# Altium schematic sheet conroller_flying_pcb.SchDoc
size A3
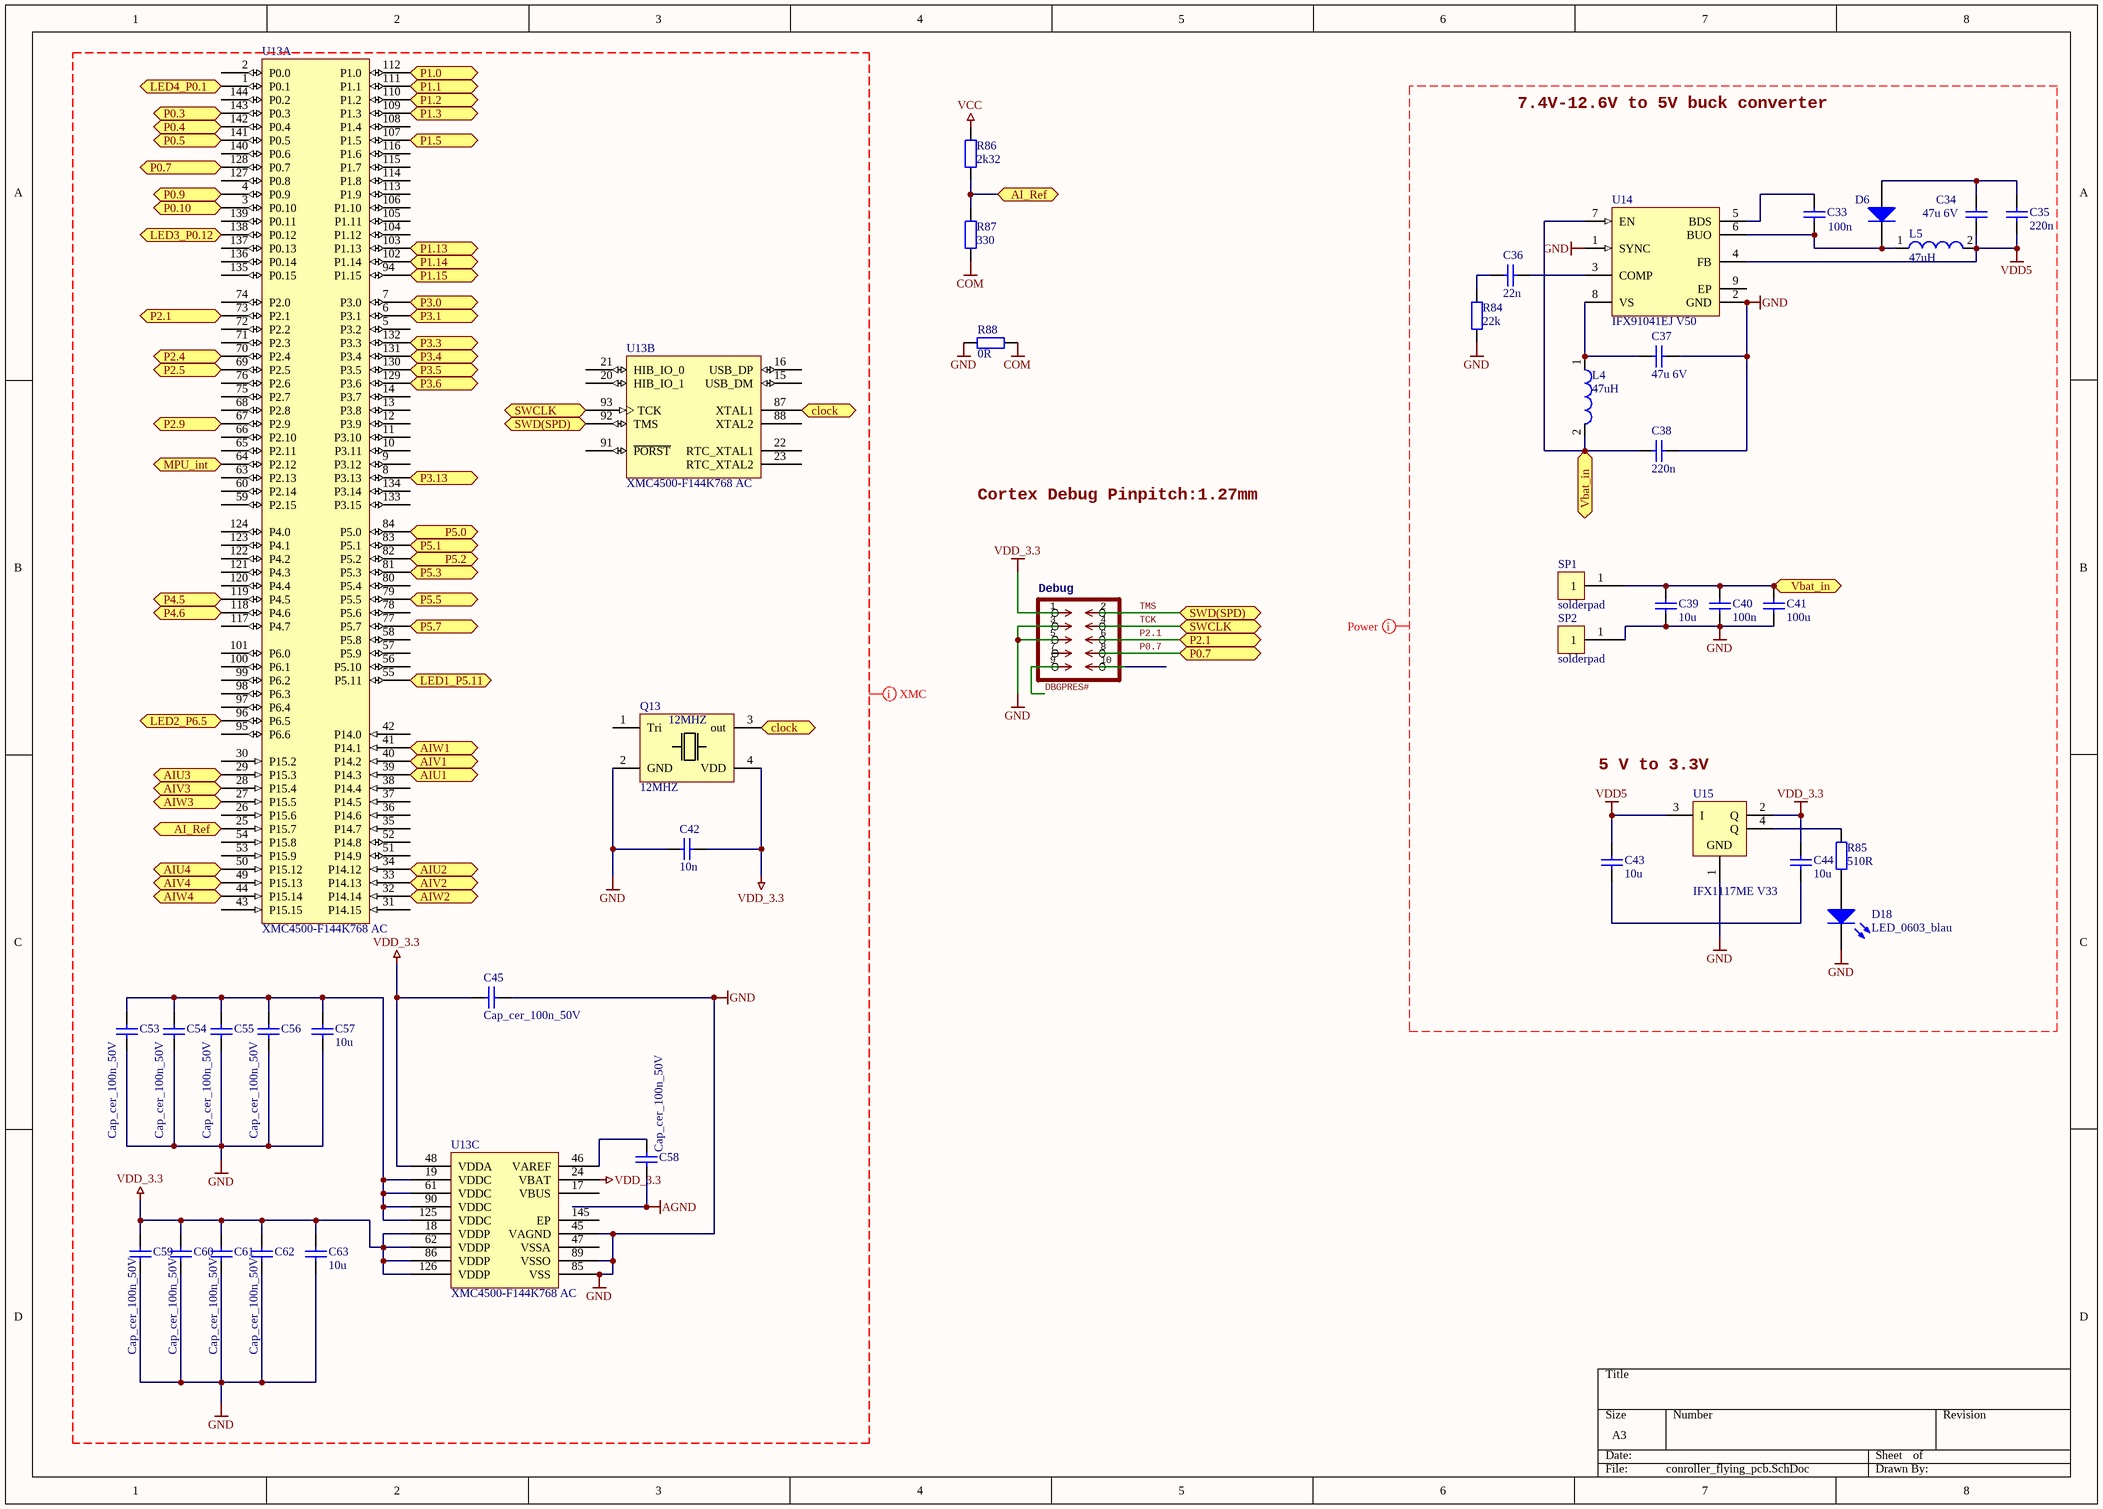
[diagram p0: conroller_flying_pcb.SchDoc]

## Parts
C33  100n  [_0603]
C34  47u 6V  [_0805]
C35  220n  [_0603]
C36  22n  [_0603]
C37  47u 6V  [_0805]
C38  220n  [_0603]
C39  10u  [_0603]
C40  100n  [_0603]
C41  100u  [_0603]
C42  10n  [_0603]
C43  10u  [_0603]
C44  10u  [_0603]
C45  Cap_cer_100n_50V  [1608[0603]]
C53  Cap_cer_100n_50V  [1608[0603]]
C54  Cap_cer_100n_50V  [1608[0603]]
C55  Cap_cer_100n_50V  [1608[0603]]
C56  Cap_cer_100n_50V  [1608[0603]]
C57  10u  [_0603]
C58  Cap_cer_100n_50V  [1608[0603]]
C59  Cap_cer_100n_50V  [1608[0603]]
C60  Cap_cer_100n_50V  [1608[0603]]
C61  Cap_cer_100n_50V  [1608[0603]]
C62  Cap_cer_100n_50V  [1608[0603]]
C63  10u  [_0603]
D6  BAS21-03W  [INF-SOD323_V_1PRIMARY]  (value not drawn)
D18  LED_0603_blau  [LED_0603]
Debug  FTSH-105-01-F-D-K  [FTSH-105-01-F-D-K]  (value not drawn)
L4  47uH  [WE-TPC-3816-S]
L5  47uH  [WE-TPC-3816-S]
Q13  12MHZ  [cmos crystal]
R84  22k  [_0603]
R85  510R  [_0603]
R86  value 2k32  [1608[0603]]  (hidden comment: Res_0603)
R87  value 330  [1608[0603]]  (hidden comment: Res_0603)
R88  value 0R  [1608[0603]]  (hidden comment: Res_0603)
SP1  solderpad  [solderpad1]
SP2  solderpad  [solderpad1]
U13  XMC4500-F144K768 AC  [INF-PG-LQFP-144-18-6500X6500TP_N]  (parts A,B,C of 3)
U14  IFX91041EJ V50  [INF-PG-DSO-8-27_N]
U15  IFX1117ME V33  [INF-PG-SOT223_SC-73_N]

## Ports
AI_Ref (bidir), AIU1, AIU2, AIU3, AIU4, AIV1, AIV2, AIV3, AIV4, AIW1, AIW2, AIW3, AIW4, clock, LED1_P5.11, LED2_P6.5, LED3_P0.12, LED4_P0.1, MPU_int, P0.3, P0.4, P0.5, P0.7, P0.9, P0.10, P1.0, P1.1, P1.2, P1.3, P1.5, P1.13, P1.14, P1.15, P2.1, P2.4, P2.5, P2.9, P3.0, P3.1, P3.3, P3.4, P3.5, P3.6, P3.13, P4.5, P4.6, P5.0, P5.1, P5.2, P5.3, P5.5, P5.7, SWCLK, SWD(SPD), Vbat_in

## Nets
AGND: C58.2
COM: R87.2 R88.2
GND: C37.1 C38.1 C39.2 C40.2 C41.2 C42.1 C45.1 C53.1 C54.1 C55.1 C56.1 C57.1 C59.1 C60.1 C61.1 C62.1 C63.1 D18.2 Debug.3 Debug.5 Q13.2(GND) R84.1 R88.1 SP2.1 U13.45(VAGND) U13.85(VSS) U13.89(VSSO) U14.1(SYNC) U14.2(GND) U15.1(GND)
VCC: R86.1
VDD5: C34.1 C35.2 C43.2 L5.2 U14.4(FB) U15.3(I)
VDD_3.3: C42.2 C44.2 C45.2 C59.2 C60.2 C61.2 C62.2 C63.2 Debug.1 Q13.4(VDD) U13.18(VDDP) U13.24(VBAT) U13.48(VDDA) U13.62(VDDP) U13.86(VDDP) U13.126(VDDP) U15.2(Q)
AI_Ref: R86.2 R87.1 U13.25(P15.7) ; port AI_Ref
AIU1: U13.39(P14.3) ; port AIU1
AIU2: U13.34(P14.12) ; port AIU2
AIU3: U13.29(P15.3) ; port AIU3
AIU4: U13.50(P15.12) ; port AIU4
AIV1: U13.40(P14.2) ; port AIV1
AIV2: U13.33(P14.13) ; port AIV2
AIV3: U13.28(P15.4) ; port AIV3
AIV4: U13.49(P15.13) ; port AIV4
AIW1: U13.41(P14.1) ; port AIW1
AIW2: U13.32(P14.14) ; port AIW2
AIW3: U13.27(P15.5) ; port AIW3
AIW4: U13.44(P15.14) ; port AIW4
clock: Q13.3(out) U13.87(XTAL1) ; port clock
DBGPRES#: Debug.9
LED1_P5.11: U13.55(P5.11) ; port LED1_P5.11
LED2_P6.5: U13.96(P6.5) ; port LED2_P6.5
LED3_P0.12: U13.138(P0.12) ; port LED3_P0.12
LED4_P0.1: U13.1(P0.1) ; port LED4_P0.1
MPU_int: U13.64(P2.12) ; port MPU_int
P0.3: U13.143(P0.3) ; port P0.3
P0.4: U13.142(P0.4) ; port P0.4
P0.5: U13.141(P0.5) ; port P0.5
P0.7: Debug.8 U13.128(P0.7) ; port P0.7
P0.9: U13.4(P0.9) ; port P0.9
P0.10: U13.3(P0.10) ; port P0.10
P1.0: U13.112(P1.0) ; port P1.0
P1.1: U13.111(P1.1) ; port P1.1
P1.2: U13.110(P1.2) ; port P1.2
P1.3: U13.109(P1.3) ; port P1.3
P1.5: U13.107(P1.5) ; port P1.5
P1.13: U13.103(P1.13) ; port P1.13
P1.14: U13.102(P1.14) ; port P1.14
P1.15: U13.94(P1.15) ; port P1.15
P2.1: Debug.6 U13.73(P2.1) ; port P2.1
P2.4: U13.70(P2.4) ; port P2.4
P2.5: U13.69(P2.5) ; port P2.5
P2.9: U13.67(P2.9) ; port P2.9
P3.0: U13.7(P3.0) ; port P3.0
P3.1: U13.6(P3.1) ; port P3.1
P3.3: U13.132(P3.3) ; port P3.3
P3.4: U13.131(P3.4) ; port P3.4
P3.5: U13.130(P3.5) ; port P3.5
P3.6: U13.129(P3.6) ; port P3.6
P3.13: U13.8(P3.13) ; port P3.13
P4.5: U13.119(P4.5) ; port P4.5
P4.6: U13.118(P4.6) ; port P4.6
P5.0: U13.84(P5.0) ; port P5.0
P5.1: U13.83(P5.1) ; port P5.1
P5.2: U13.82(P5.2) ; port P5.2
P5.3: U13.81(P5.3) ; port P5.3
P5.5: U13.79(P5.5) ; port P5.5
P5.7: U13.77(P5.7) ; port P5.7
TCK: Debug.4 U13.93(TCK) ; port SWCLK
TMS: Debug.2 U13.92(TMS) ; port SWD(SPD)
Vbat_in: C38.2 C39.1 C40.1 C41.1 L4.2 SP1.1 U14.7(EN) ; port Vbat_in
NetC33_1: C33.1 U14.5(BDS)
NetC33_2: C33.2 D6.2 L5.1 U14.6(BUO)
NetC34_2: C34.2 C35.1 D6.1
NetC36_1: C36.1 U14.3(COMP)
NetC36_2: C36.2 R84.2
NetC37_2: C37.2 L4.1 U14.8(VS)
NetC43_1: C43.1 C44.1
NetC53_2: C53.2 C54.2 C55.2 C56.2 C57.2 U13.19(VDDC) U13.61(VDDC) U13.90(VDDC) U13.125(VDDC)
NetC58_1: C58.1 U13.46(VAREF)
NetD18_1: D18.1 R85.1
NetR85_2: R85.2 U15.4(Q)

Not connected (* = marked no-connect by the designer): Debug 7 10; Q13 1(Tri); U13 2(P0.0) 5(P3.2) 9(P3.12) 10(P3.11) 11(P3.10) 12(P3.9) 13(P3.8) 14(P3.7) 15(USB_DM) 16(USB_DP) 17(VBUS) 20(HIB_IO_1) 21(HIB_IO_0) 22(RTC_XTAL1) 23(RTC_XTAL2) 26(P15.6) 30(P15.2) 31(P14.15) 35(P14.7) 36(P14.6) 37(P14.5) 38(P14.4) 42(P14.0) 43(P15.15) 47(VSSA) 51(P14.9) 52(P14.8) 53(P15.9) 54(P15.8) 56(P5.10) 57(P5.9) 58(P5.8) 59(P2.15) 60(P2.14) 63(P2.13) 65(P2.11) 66(P2.10) 68(P2.8) 71(P2.3) 72(P2.2) 74(P2.0) 75(P2.7) 76(P2.6) 78(P5.6) 80(P5.4) 88(XTAL2) 91(~{PORST}) 95(P6.6) 97(P6.4) 98(P6.3) 99(P6.2) 100(P6.1) 101(P6.0) 104(P1.12) 105(P1.11) 106(P1.10) 108(P1.4) 113(P1.9) 114(P1.8) 115(P1.7) 116(P1.6) 117(P4.7) 120(P4.4) 121(P4.3) 122(P4.2) 123(P4.1) 124(P4.0) 127(P0.8) 133(P3.15) 134(P3.14) 135(P0.15) 136(P0.14) 137(P0.13) 139(P0.11) 140(P0.6) 144(P0.2) 145(EP); U14 9(EP)

## Layout directives
net class Undefined: AGND, GND, VDD5, VDD_3.3

## Notes on the sheet
- 7.4V-12.6V to 5V buck converter
- Cortex Debug
  Pinpitch:1.27mm
- (near U15) 5 V to 3.3V

## Library data of the parts
C33 C35 C36 C38-C44 C57 C63 = Cap_129: Name: Cap_0603; QR: 0; UID: Cap_129; ComponentLink1URL: #NAME?; mounting: SMD
C34 C37 = Cap_133: Name: Cap_cer_1u_50V; RS_number: 723-6350; QR: 0; Capacity: 1u; Voltage: 50V; UID: Cap_133; Name_Hyperlink: http://at.rs-online.com/web/p/keramik-multilayer-kondensatoren/7236350/; ComponentLink1URL: #NAME?; mounting: SMD
C45 C53-C56 C58-C62 = Cap_124: QR: 0; Capacity: 100n; Voltage: 50V; RS Bestellnummer: 788-2985; UID: Cap_124; Name: Cap_cer_100n_50V; ComponentLink1URL: #NAME?; mounting: SMD0603
D6 = INF-SOD323_V_1
D18 = DIODE_60: Type: LED; Colour: blau; RS_number: 697-3610P; QR: 0; UID: DIODE_60; Name: LED_0603_blau; Name_Hyperlink: http://at.rs-online.com/web/p/products/6973610P/; ComponentLink1URL: #WERT!; mounting: SMD
L4 L5 = 744031001: SMD Shielded Tiny Power Inductor WE-TPC, L = 1.50 µH; Inductance: 1.50 µH; DatasheetVersion: ver 6, Jan-2009; PackageReference: WE-TPC-3816-S; PackageDescription: SMD Inductor, 2-Leads, Body 3.8 x 3.8 mm; PartNumber: 744031001; ComponentLink1Description: Manufacturer URL; ComponentLink1URL: http://www.we-online.com; ComponentLink2Description: Datasheet; ComponentLink2URL: http://www.we-online.de/katalog/media/pdf/744031001.pdf
Q13 = cmos crystal: cmos smd crystal 3,3V; RS Bestellnummer: 703-2344; Spannung: 3.3V; Frequenz: 12MHZ; Typ: SMD
R84 R85 = Res_5: Name: Res_0603; UID: Res_5; ComponentLink1URL: #NAME?; mounting: SMD
R86-R88 = Res_6: UID: Res_6; Name: Res_0603; ComponentLink1URL: #NAME?; mounting: SMD
U13 = XMC4500-F144K768 AC: 120 MHz XMC4500 MCU with 768 KByte Program Memory, 160 KByte SRAM, 3.3 V, -40 to 125 degC, PG-LQFP-144, Tray, Green; Manufacturer: Infineon; A / D input lines (incl. FADC): 26; Digital I/O Lines: 91; Green: TRUE; I/O Operation Voltages: 3.3 V; Instruction set architecture: ARM(R) Cortex(TM)-M4 (32-bit); Max Clock Frequency: 120 MHz; Type of Memory: Flash; Type of Serial I/O Interfaces: UART,SPI,I2C,I2S,LIN,CAN,Ethernet 10/100,USB; DatasheetVersion: Rev. 1.3; PackageReference: PG-LQFP-144-18; PackageDescription: 144-Pin Plastic (Green) Low Profile Quad Flat Package, 20 x 20 mm Body, 0.5 mm Pitch; Group: XMC4500; Halogen-free: TRUE; Packing: Tray; Program Memory: 768 KByte; SRAM (incl. Cache): 160 KByte; Mounting Technology: Surface Mount; PartNumber: XMC4500-F144K768 AC; ComponentLink1Description: Manufacturer URL; ComponentLink1URL: http://www.infineon.com/; ComponentLink2Description: Datasheet; ComponentLink2URL: http://www.infineon.com/dgdl/xmc4500_ds_v1.3_2014_03.pdf?folderId=db3a30433580b3710135a47f3eb76c98&fileId=db3a304335b504400135bdca7ed86742; ComponentLink3Description: Package Specification; ComponentLink3URL: http://www.infineon.com/cms/packages/SMD_-_Surface_Mounted_Devices/P-PG-LQFP/P-PG-LQFP-144-04x_13x_14x_15x_16x_18x_23.html?__locale=en
U14 = IFX91041EJ V50: 1.8 A DC/DC Step-Down Voltage Regulator, -40 to 150 degC, PG-DSO-8-27, Reel, Green; Manufacturer: Infineon; Green: TRUE; IQ (max): 1,800 mA; Iq (typ): 7,000 uA; Max Number Reflow: 3; Max Peak Reflow Temp: 260 degreesC; Output: Buck Converter; Reset: FALSE; Tolerance: 2(4)%; VQ (max): 5 V; DatasheetVersion: Rev. 1.1; PackageVersion: V01, 06/2012; PackageReference: PG-DSO-8-27; PackageDescription: 8-Pin Plastic (Green) Dual Small Outline Package, 4.9 x 3.9 mm Body, 1.27 mm Pitch; Supplier 1: Mouser; Supplier Part Number 1: 726-IFX91041EJV50; Supplier 2: Newark; Supplier Part Number 2: 78X5181; Supplier 3: Farnell; Supplier Part Number 3: 2432504; Supplier 4: Digi-Key; Supplier Part Number 4: IFX91041EJ V50INTR-ND; Supplier 5: Digi-Key; Supplier Part Number 5: IFX91041EJ V50INCT-ND; Supplier 6: Digi-Key; Supplier Part Number 6: IFX91041EJ V50INDKR-ND; Halogen-free: TRUE; Inhibit: TRUE; MSL: 3; Packing: Reel; Protect: TRUE; Mounting Technology: Surface Mount; Code_JEDEC: MS-012; PartNumber: IFX91041EJ V50; ComponentLink1Description: Manufacturer URL; ComponentLink1URL: http://www.infineon.com/; ComponentLink2Description: Datasheet; ComponentLink2URL: http://www.infineon.com/dgdl/IFX91041_DS_11.pdf?folderId=db3a304314dca3890115039cf70d0bf0&fileId=db3a304320d39d59012153afb91a0548; ComponentLink3Description: Package Specification; ComponentLink3URL: http://www.infineon.com/dgdl/ILD4071_DS_V10_November2011.pdf?folderId=db3a30431f848401011fcbf2ab4c04c4&fileId=db3a30433784a04001380498fdf04c32
U15 = IFX1117ME V33: Voltage Regulator, 4.55 to 15 V Operating, 1000 mA, -40 to 125 degC, PG-SOT223 (SC-73), Reel, Green; Manufacturer: Infineon; Accuracy: 2.0 %; Automotive Qualified: FALSE; Dropout Voltage: 1200 mV; Green: TRUE; Max Number Reflow: 3; Max Peak Reflow Temp: 260 degC; Max. Output Current: 1000 mA; Output Voltage: 3.3 V; Regulator Type: Linear->single output; Typical Quiescent Current: 5000 uA; DatasheetVersion: Rev. 1.0; PackageVersion: Apr-08; PackageReference: PG-SOT223 (SC-73); PackageDescription: 4-Pin Small Outline Transistor Package, 6.5 x 3.5 mm Body, 2.3 mm Pitch; Supplier 1: Mouser; Supplier Part Number 1: 726-IFX1117MEV33; Supplier 2: Digi-Key; Supplier Part Number 2: IFX1117ME V33TR-ND; Supplier 3: Digi-Key; Supplier Part Number 3: IFX1117ME V33CT-ND; Supplier 4: Digi-Key; Supplier Part Number 4: IFX1117ME V33DKR-ND; MSL: 1; Packing: Reel; Reset: FALSE; Status Output: FALSE; Mounting Technology: Surface Mount; PartNumber: IFX1117ME V33; ComponentLink1Description: Manufacturer URL; ComponentLink1URL: http://www.infineon.com/; ComponentLink2Description: Datasheet; ComponentLink2URL: http://www.infineon.com/dgdl/IFX1117ME+V33.pdf?folderId=db3a304318f3fe290118f5a433570040&fileId=db3a30432e779412012e9097d1611987; ComponentLink3Description: Package Specification; ComponentLink3URL: http://www.infineon.com/dgdl/SOT223-Package_Overview.pdf?folderId=db3a30431936bc4b0119530470b03c3d&fileId=db3a30431936bc4b0119531d40b93c5c